# Altium project FLEXI_HAL_Quark.PrjPCB (part 5 of 5)
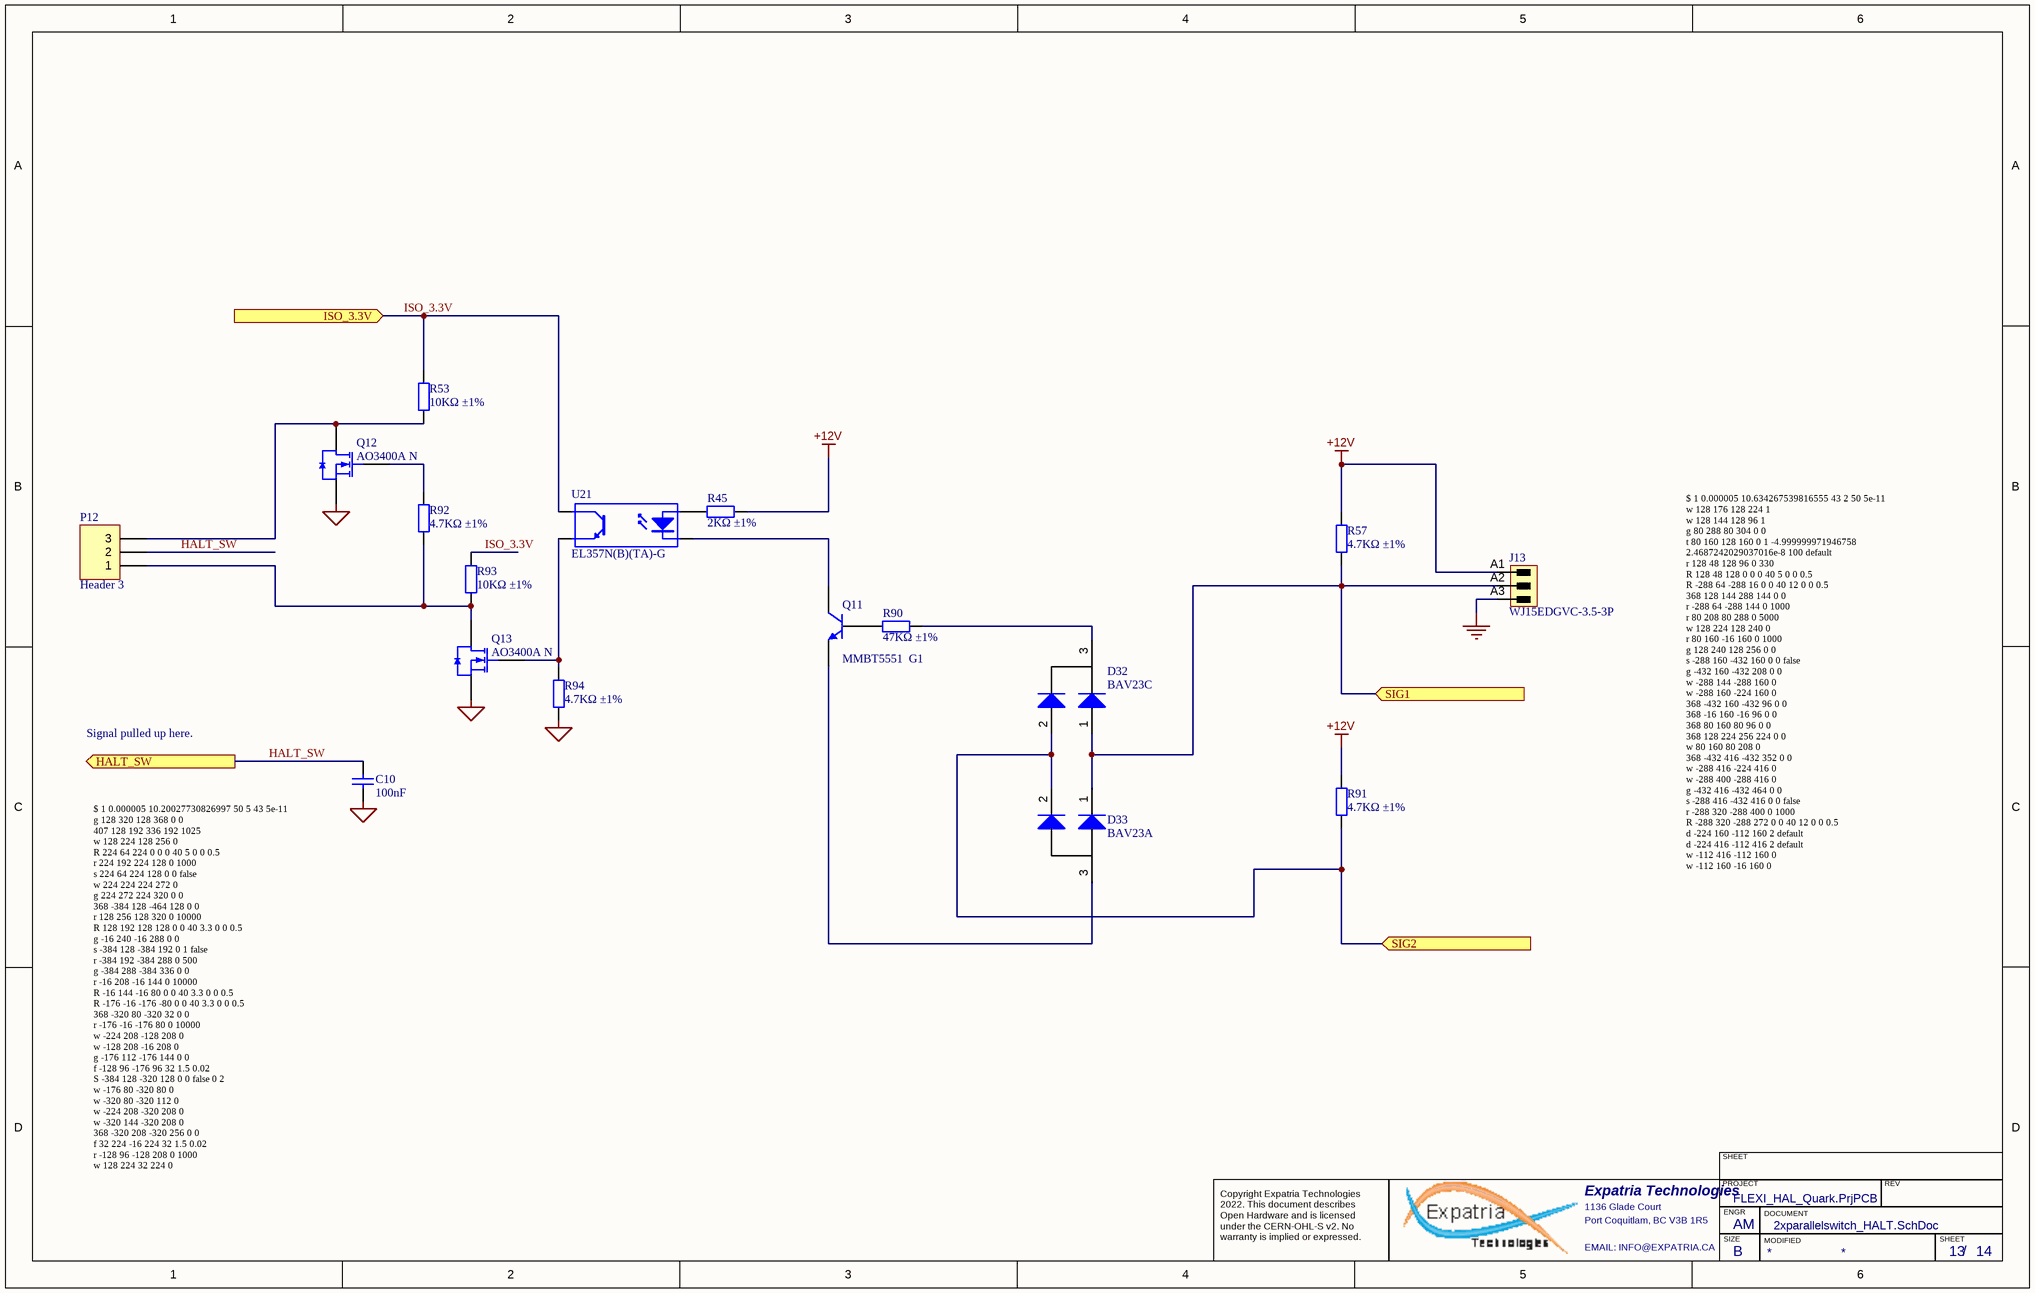
[diagram p23: 2xparallelswitch_HALT.SchDoc]

## Nets that join several sheets
+3.3V: Flexi_Quark_board (D24.A), STM32F446 CNC Controller/ST/SX (5 pins), STM32F446 CNC Controller/ST/SY (5 pins), STM32F446 CNC Controller/ST/SZ (5 pins), STM32F446 CNC Controller/ST/SA (5 pins), STM32F446 CNC Controller/ST/SB (5 pins), STM32F446 CNC Controller/ST/SC (5 pins), STM32F446 CNC Controller/ST/AO (R64_STM32F446_CNC_Controller_ST_AO#1.2), STM32F446 CNC Controller/ST/AO (R178_STM32F446_CNC_Controller_ST_AO#2.2), STM32F446 CNC Controller/MODBUS/RS (R65_RS.2), MCU_STM32H723ZGT6 (48 pins), Ethernet_Interface (6 pins), USB_ULPI_Interface (9 pins), STM32F446 CNC Controller/Pendant RT Interface/CB (R65_CB.2), STM32F446 CNC Controller/4 Encoder Inputs/EI (R178_STM32F446_CNC_Controller_4_Encoder_Inputs_EI#1.2), STM32F446 CNC Controller/4 Encoder Inputs/EI (R178_STM32F446_CNC_Controller_4_Encoder_Inputs_EI#2.2), STM32F446 CNC Controller/4 Encoder Inputs/EI (R178_STM32F446_CNC_Controller_4_Encoder_Inputs_EI#3.2), STM32F446 CNC Controller/4 Encoder Inputs/EI (R178_STM32F446_CNC_Controller_4_Encoder_Inputs_EI#4.2), STM32F446 CNC Controller/4 Encoder Inputs/EI (R178_STM32F446_CNC_Controller_4_Encoder_Inputs_EI#5.2), STM32F446 CNC Controller/4 Encoder Inputs/EI (R178_STM32F446_CNC_Controller_4_Encoder_Inputs_EI#6.2), Serial_Expansion (D40.2 R136.2), Limit_Switches (6 pins), STM32F446 CNC Controller/Mezzanine Connector/LIM_SW/PH_DR (R20_STM32F446_CNC_Controller_Mezzanine_Connector_LIM_SW_PH_DR#1.2), STM32F446 CNC Controller/Mezzanine Connector/LIM_SW/PH_DR (R20_STM32F446_CNC_Controller_Mezzanine_Connector_LIM_SW_PH_DR#2.2), STM32F446 CNC Controller/Mezzanine Connector/LIM_SW/PH_DR (R20_STM32F446_CNC_Controller_Mezzanine_Connector_LIM_SW_PH_DR#3.2), STM32F446 CNC Controller/Mezzanine Connector/LIM_SW/PH_DR (R20_STM32F446_CNC_Controller_Mezzanine_Connector_LIM_SW_PH_DR#4.2), STM32F446 CNC Controller/Mezzanine Connector/LIM_SW/PH_DR (R20_STM32F446_CNC_Controller_Mezzanine_Connector_LIM_SW_PH_DR#5.2), STM32F446 CNC Controller/Mezzanine Connector/LIM_SW/PH_DR (R20_STM32F446_CNC_Controller_Mezzanine_Connector_LIM_SW_PH_DR#6.2), Misc_switches (5 pins), STM32F446 CNC Controller/Mezzanine Connector/USR_SW/PH_CY (R20_PH_CY.2), STM32F446 CNC Controller/Mezzanine Connector/USR_SW/PH_FD (R20_PH_FD.2), STM32F446 CNC Controller/Mezzanine Connector/USR_SW/PH_DR (R20_STM32F446_CNC_Controller_Mezzanine_Connector_USR_SW_PH_DR.2), STM32F446 CNC Controller/Mezzanine Connector/USR_SW/PH_TL (R20_PH_TL.2), STM32F446 CNC Controller/Mezzanine Connector/USR_SW/PH_PR (R20_PH_PR.2), STM32F446 CNC Controller/Mezzanine Connector/AUX_I/AI (R178_STM32F446_CNC_Controller_Mezzanine_Connector_AUX_I_AI#1.2), STM32F446 CNC Controller/Mezzanine Connector/AUX_I/AI (R178_STM32F446_CNC_Controller_Mezzanine_Connector_AUX_I_AI#2.2), STM32F446 CNC Controller/Mezzanine Connector/MZ (R64_STM32F446_CNC_Controller_Mezzanine_Connector_MZ#1.2), STM32F446 CNC Controller/Mezzanine Connector/MZ (R64_STM32F446_CNC_Controller_Mezzanine_Connector_MZ#2.2), STM32F446 CNC Controller/Mezzanine Connector/MZ (R64_STM32F446_CNC_Controller_Mezzanine_Connector_MZ#3.2), STM32F446 CNC Controller/Mezzanine Connector/MZ (R64_STM32F446_CNC_Controller_Mezzanine_Connector_MZ#4.2), STM32F446 CNC Controller/Mezzanine Connector/MZ (R64_STM32F446_CNC_Controller_Mezzanine_Connector_MZ#5.2), STM32F446 CNC Controller/Mezzanine Connector/MZ (R64_STM32F446_CNC_Controller_Mezzanine_Connector_MZ#6.2), 2xparallelswitch_HALT (R53.2 R93.2 U21.4)
+5V: Flexi_Quark_board (C49.2 D2.A D19.2 L1.1), STM32F446 CNC Controller/ST/SX (11 pins), STM32F446 CNC Controller/ST/SY (11 pins), STM32F446 CNC Controller/ST/SZ (11 pins), STM32F446 CNC Controller/ST/SA (11 pins), STM32F446 CNC Controller/ST/SB (11 pins), STM32F446 CNC Controller/ST/SC (11 pins), STM32F446 CNC Controller/ST/AO (R178_STM32F446_CNC_Controller_ST_AO#1.2), STM32F446 CNC Controller/ST/AO (R64_STM32F446_CNC_Controller_ST_AO#2.2), RS485 (C108.2 L4.1 R89.2), 5V_Power_Supply (6 pins), CANBUS_Pendant (6 pins), STM32F446 CNC Controller/Pendant RT Interface/CB (R60_CB.2), Encoder_Input (12 pins), STM32F446 CNC Controller/4 Encoder Inputs/U_ENC0 (J2_U_ENC0.7), STM32F446 CNC Controller/4 Encoder Inputs/U_ENC1 (J2_U_ENC1.7), STM32F446 CNC Controller/4 Encoder Inputs/U_ENC2 (J2_U_ENC2.7), STM32F446 CNC Controller/4 Encoder Inputs/U_ENC3 (J2_U_ENC3.7), STM32F446 CNC Controller/4 Encoder Inputs/EI (R64_STM32F446_CNC_Controller_4_Encoder_Inputs_EI#1.2), STM32F446 CNC Controller/4 Encoder Inputs/EI (R64_STM32F446_CNC_Controller_4_Encoder_Inputs_EI#2.2), STM32F446 CNC Controller/4 Encoder Inputs/EI (R64_STM32F446_CNC_Controller_4_Encoder_Inputs_EI#3.2), STM32F446 CNC Controller/4 Encoder Inputs/EI (R64_STM32F446_CNC_Controller_4_Encoder_Inputs_EI#4.2), STM32F446 CNC Controller/4 Encoder Inputs/EI (R64_STM32F446_CNC_Controller_4_Encoder_Inputs_EI#5.2), STM32F446 CNC Controller/4 Encoder Inputs/EI (R64_STM32F446_CNC_Controller_4_Encoder_Inputs_EI#6.2), Serial_Expansion (11 pins), Mezz_connector (P2.10), Aux_Inputs (D30.2 D31.2 D35.2 D37.2), STM32F446 CNC Controller/Mezzanine Connector/AUX_I/AI (R64_STM32F446_CNC_Controller_Mezzanine_Connector_AUX_I_AI#1.2), STM32F446 CNC Controller/Mezzanine Connector/AUX_I/AI (R64_STM32F446_CNC_Controller_Mezzanine_Connector_AUX_I_AI#2.2), STM32F446 CNC Controller/Mezzanine Connector/MZ (R178_STM32F446_CNC_Controller_Mezzanine_Connector_MZ#1.2), STM32F446 CNC Controller/Mezzanine Connector/MZ (R178_STM32F446_CNC_Controller_Mezzanine_Connector_MZ#2.2), STM32F446 CNC Controller/Mezzanine Connector/MZ (R178_STM32F446_CNC_Controller_Mezzanine_Connector_MZ#3.2), STM32F446 CNC Controller/Mezzanine Connector/MZ (R178_STM32F446_CNC_Controller_Mezzanine_Connector_MZ#4.2), STM32F446 CNC Controller/Mezzanine Connector/MZ (R178_STM32F446_CNC_Controller_Mezzanine_Connector_MZ#5.2), STM32F446 CNC Controller/Mezzanine Connector/MZ (R178_STM32F446_CNC_Controller_Mezzanine_Connector_MZ#6.2)
+5V_MCU: Flexi_Quark_board (7 pins), RS485 (D59.A), MCU_STM32H723ZGT6 (C12.2 VR3.3), USB_ULPI_Interface (C158.2 J5.A4B9 J5.B4A9 R159.2), CANBUS_Pendant (D57.A), Serial_Expansion (D61.A), Mezz_connector (P2.1)
+5V_RS485: RS485 (8 pins), STM32F446 CNC Controller/MODBUS/RS (R60_RS.2)
+12V: Flexi_Quark_board (D10.A D21.2 FUSE1.2 J7.1), STM32F446 CNC Controller/ST/SX (C92_SX.2 P15_SX.9 QS1_SX.JP1_9), STM32F446 CNC Controller/ST/SY (C92_SY.2 P15_SY.9 QS1_SY.JP1_9), STM32F446 CNC Controller/ST/SZ (C92_SZ.2 P15_SZ.9 QS1_SZ.JP1_9), STM32F446 CNC Controller/ST/SA (C92_SA.2 P15_SA.9 QS1_SA.JP1_9), STM32F446 CNC Controller/ST/SB (C92_SB.2 P15_SB.9 QS1_SB.JP1_9), STM32F446 CNC Controller/ST/SC (C92_SC.2 P15_SC.9 QS1_SC.JP1_9), 5V_Power_Supply (C46.2 C47.2 U23.2), Mezz_connector (P2.12), 2xparallelswitch_HALT (J13.A1 R45.2 R57.2 R91.2)
GND: Flexi_Quark_board (11 pins), STM32F446 CNC Controller/ST/SX (25 pins), STM32F446 CNC Controller/ST/SY (25 pins), STM32F446 CNC Controller/ST/SZ (25 pins), STM32F446 CNC Controller/ST/SA (25 pins), STM32F446 CNC Controller/ST/SB (25 pins), STM32F446 CNC Controller/ST/SC (25 pins), STM32F446 CNC Controller/ST/AO (C67_STM32F446_CNC_Controller_ST_AO#1.1 U33_STM32F446_CNC_Controller_ST_AO#1.5), STM32F446 CNC Controller/ST/AO (C68_STM32F446_CNC_Controller_ST_AO#2.2 U33_STM32F446_CNC_Controller_ST_AO#2.4), RS485 (C108.1 L6.1), STM32F446 CNC Controller/MODBUS/RS (C1_RS.1), 5V_Power_Supply (12 pins), 12V_Power_Supply (11 pins), CANBUS_Pendant (6 pins), STM32F446 CNC Controller/Pendant RT Interface/CB (C1_CB.1 U16_CB.5), Encoder_Input (12 pins), STM32F446 CNC Controller/4 Encoder Inputs/U_ENC0 (J2_U_ENC0.2 J2_U_ENC0.4), STM32F446 CNC Controller/4 Encoder Inputs/U_ENC1 (J2_U_ENC1.2 J2_U_ENC1.4), STM32F446 CNC Controller/4 Encoder Inputs/U_ENC2 (J2_U_ENC2.2 J2_U_ENC2.4), STM32F446 CNC Controller/4 Encoder Inputs/U_ENC3 (J2_U_ENC3.2 J2_U_ENC3.4), STM32F446 CNC Controller/4 Encoder Inputs/EI (C68_STM32F446_CNC_Controller_4_Encoder_Inputs_EI#1.2 U33_STM32F446_CNC_Controller_4_Encoder_Inputs_EI#1.4), STM32F446 CNC Controller/4 Encoder Inputs/EI (C68_STM32F446_CNC_Controller_4_Encoder_Inputs_EI#2.2 U33_STM32F446_CNC_Controller_4_Encoder_Inputs_EI#2.4), STM32F446 CNC Controller/4 Encoder Inputs/EI (C68_STM32F446_CNC_Controller_4_Encoder_Inputs_EI#3.2 U33_STM32F446_CNC_Controller_4_Encoder_Inputs_EI#3.4), STM32F446 CNC Controller/4 Encoder Inputs/EI (C68_STM32F446_CNC_Controller_4_Encoder_Inputs_EI#4.2 U33_STM32F446_CNC_Controller_4_Encoder_Inputs_EI#4.4), STM32F446 CNC Controller/4 Encoder Inputs/EI (C68_STM32F446_CNC_Controller_4_Encoder_Inputs_EI#5.2 U33_STM32F446_CNC_Controller_4_Encoder_Inputs_EI#5.4), STM32F446 CNC Controller/4 Encoder Inputs/EI (C68_STM32F446_CNC_Controller_4_Encoder_Inputs_EI#6.2 U33_STM32F446_CNC_Controller_4_Encoder_Inputs_EI#6.4), Serial_Expansion (14 pins), Mezz_connector (10 pins), Aux_Inputs (D49.1 D50.1 D51.1 D52.1), STM32F446 CNC Controller/Mezzanine Connector/AUX_I/AI (C68_STM32F446_CNC_Controller_Mezzanine_Connector_AUX_I_AI#1.2 U33_STM32F446_CNC_Controller_Mezzanine_Connector_AUX_I_AI#1.4), STM32F446 CNC Controller/Mezzanine Connector/AUX_I/AI (C68_STM32F446_CNC_Controller_Mezzanine_Connector_AUX_I_AI#2.2 U33_STM32F446_CNC_Controller_Mezzanine_Connector_AUX_I_AI#2.4), STM32F446 CNC Controller/Mezzanine Connector/MZ (C67_STM32F446_CNC_Controller_Mezzanine_Connector_MZ#1.1 U33_STM32F446_CNC_Controller_Mezzanine_Connector_MZ#1.5), STM32F446 CNC Controller/Mezzanine Connector/MZ (C67_STM32F446_CNC_Controller_Mezzanine_Connector_MZ#2.1 U33_STM32F446_CNC_Controller_Mezzanine_Connector_MZ#2.5), STM32F446 CNC Controller/Mezzanine Connector/MZ (C67_STM32F446_CNC_Controller_Mezzanine_Connector_MZ#3.1 U33_STM32F446_CNC_Controller_Mezzanine_Connector_MZ#3.5), STM32F446 CNC Controller/Mezzanine Connector/MZ (C67_STM32F446_CNC_Controller_Mezzanine_Connector_MZ#4.1 U33_STM32F446_CNC_Controller_Mezzanine_Connector_MZ#4.5), STM32F446 CNC Controller/Mezzanine Connector/MZ (C67_STM32F446_CNC_Controller_Mezzanine_Connector_MZ#5.1 U33_STM32F446_CNC_Controller_Mezzanine_Connector_MZ#5.5), STM32F446 CNC Controller/Mezzanine Connector/MZ (C67_STM32F446_CNC_Controller_Mezzanine_Connector_MZ#6.1 U33_STM32F446_CNC_Controller_Mezzanine_Connector_MZ#6.5), 2xparallelswitch_HALT (J13.A3)
MCU_GND: Flexi_Quark_board (13 pins), Stepper_driver_group (C9.2), STM32F446 CNC Controller/ST/SX (9 pins), STM32F446 CNC Controller/ST/SY (9 pins), STM32F446 CNC Controller/ST/SZ (9 pins), STM32F446 CNC Controller/ST/SA (9 pins), STM32F446 CNC Controller/ST/SB (9 pins), STM32F446 CNC Controller/ST/SC (9 pins), STM32F446 CNC Controller/ST/AO (C68_STM32F446_CNC_Controller_ST_AO#1.2 U33_STM32F446_CNC_Controller_ST_AO#1.4), STM32F446 CNC Controller/ST/AO (C67_STM32F446_CNC_Controller_ST_AO#2.1 U33_STM32F446_CNC_Controller_ST_AO#2.5), RS485 (Q18.2), STM32F446 CNC Controller/MODBUS/RS (C2_RS.2 U16_RS.4), MCU_STM32H723ZGT6 (58 pins), Ethernet_Interface (17 pins), USB_ULPI_Interface (24 pins), CANBUS_Pendant (Q17.2), STM32F446 CNC Controller/Pendant RT Interface/CB (C2_CB.2 U16_CB.4), STM32F446 CNC Controller/4 Encoder Inputs/EI (C67_STM32F446_CNC_Controller_4_Encoder_Inputs_EI#1.1 U33_STM32F446_CNC_Controller_4_Encoder_Inputs_EI#1.5), STM32F446 CNC Controller/4 Encoder Inputs/EI (C67_STM32F446_CNC_Controller_4_Encoder_Inputs_EI#2.1 U33_STM32F446_CNC_Controller_4_Encoder_Inputs_EI#2.5), STM32F446 CNC Controller/4 Encoder Inputs/EI (C67_STM32F446_CNC_Controller_4_Encoder_Inputs_EI#3.1 U33_STM32F446_CNC_Controller_4_Encoder_Inputs_EI#3.5), STM32F446 CNC Controller/4 Encoder Inputs/EI (C67_STM32F446_CNC_Controller_4_Encoder_Inputs_EI#4.1 U33_STM32F446_CNC_Controller_4_Encoder_Inputs_EI#4.5), STM32F446 CNC Controller/4 Encoder Inputs/EI (C67_STM32F446_CNC_Controller_4_Encoder_Inputs_EI#5.1 U33_STM32F446_CNC_Controller_4_Encoder_Inputs_EI#5.5), STM32F446 CNC Controller/4 Encoder Inputs/EI (C67_STM32F446_CNC_Controller_4_Encoder_Inputs_EI#6.1 U33_STM32F446_CNC_Controller_4_Encoder_Inputs_EI#6.5), Serial_Expansion (C60.2 D40.1 Q20.2 U12.4), Mezz_connector (P2.7 P2.8), STM32F446 CNC Controller/Mezzanine Connector/LIM_SW/PH_DR (C54_STM32F446_CNC_Controller_Mezzanine_Connector_LIM_SW_PH_DR#1.1 U2_STM32F446_CNC_Controller_Mezzanine_Connector_LIM_SW_PH_DR#1.3), STM32F446 CNC Controller/Mezzanine Connector/LIM_SW/PH_DR (C54_STM32F446_CNC_Controller_Mezzanine_Connector_LIM_SW_PH_DR#2.1 U2_STM32F446_CNC_Controller_Mezzanine_Connector_LIM_SW_PH_DR#2.3), STM32F446 CNC Controller/Mezzanine Connector/LIM_SW/PH_DR (C54_STM32F446_CNC_Controller_Mezzanine_Connector_LIM_SW_PH_DR#3.1 U2_STM32F446_CNC_Controller_Mezzanine_Connector_LIM_SW_PH_DR#3.3), STM32F446 CNC Controller/Mezzanine Connector/LIM_SW/PH_DR (C54_STM32F446_CNC_Controller_Mezzanine_Connector_LIM_SW_PH_DR#4.1 U2_STM32F446_CNC_Controller_Mezzanine_Connector_LIM_SW_PH_DR#4.3), STM32F446 CNC Controller/Mezzanine Connector/LIM_SW/PH_DR (C54_STM32F446_CNC_Controller_Mezzanine_Connector_LIM_SW_PH_DR#5.1 U2_STM32F446_CNC_Controller_Mezzanine_Connector_LIM_SW_PH_DR#5.3), STM32F446 CNC Controller/Mezzanine Connector/LIM_SW/PH_DR (C54_STM32F446_CNC_Controller_Mezzanine_Connector_LIM_SW_PH_DR#6.1 U2_STM32F446_CNC_Controller_Mezzanine_Connector_LIM_SW_PH_DR#6.3), STM32F446 CNC Controller/Mezzanine Connector/USR_SW/PH_CY (C54_PH_CY.1 U2_PH_CY.3), STM32F446 CNC Controller/Mezzanine Connector/USR_SW/PH_FD (C54_PH_FD.1 U2_PH_FD.3), STM32F446 CNC Controller/Mezzanine Connector/USR_SW/PH_DR (C54_STM32F446_CNC_Controller_Mezzanine_Connector_USR_SW_PH_DR.1 U2_STM32F446_CNC_Controller_Mezzanine_Connector_USR_SW_PH_DR.3), STM32F446 CNC Controller/Mezzanine Connector/USR_SW/PH_TL (C54_PH_TL.1 U2_PH_TL.3), STM32F446 CNC Controller/Mezzanine Connector/USR_SW/PH_PR (C54_PH_PR.1 U2_PH_PR.3), Aux_Inputs (R78.2 R81.2 R82.2 R87.2), STM32F446 CNC Controller/Mezzanine Connector/AUX_I/AI (C67_STM32F446_CNC_Controller_Mezzanine_Connector_AUX_I_AI#1.1 U33_STM32F446_CNC_Controller_Mezzanine_Connector_AUX_I_AI#1.5), STM32F446 CNC Controller/Mezzanine Connector/AUX_I/AI (C67_STM32F446_CNC_Controller_Mezzanine_Connector_AUX_I_AI#2.1 U33_STM32F446_CNC_Controller_Mezzanine_Connector_AUX_I_AI#2.5), STM32F446 CNC Controller/Mezzanine Connector/MZ (C68_STM32F446_CNC_Controller_Mezzanine_Connector_MZ#1.2 U33_STM32F446_CNC_Controller_Mezzanine_Connector_MZ#1.4), STM32F446 CNC Controller/Mezzanine Connector/MZ (C68_STM32F446_CNC_Controller_Mezzanine_Connector_MZ#2.2 U33_STM32F446_CNC_Controller_Mezzanine_Connector_MZ#2.4), STM32F446 CNC Controller/Mezzanine Connector/MZ (C68_STM32F446_CNC_Controller_Mezzanine_Connector_MZ#3.2 U33_STM32F446_CNC_Controller_Mezzanine_Connector_MZ#3.4), STM32F446 CNC Controller/Mezzanine Connector/MZ (C68_STM32F446_CNC_Controller_Mezzanine_Connector_MZ#4.2 U33_STM32F446_CNC_Controller_Mezzanine_Connector_MZ#4.4), STM32F446 CNC Controller/Mezzanine Connector/MZ (C68_STM32F446_CNC_Controller_Mezzanine_Connector_MZ#5.2 U33_STM32F446_CNC_Controller_Mezzanine_Connector_MZ#5.4), STM32F446 CNC Controller/Mezzanine Connector/MZ (C68_STM32F446_CNC_Controller_Mezzanine_Connector_MZ#6.2 U33_STM32F446_CNC_Controller_Mezzanine_Connector_MZ#6.4), 2xparallelswitch_HALT (C10.1 Q12.2 Q13.2 R94.1)
MOD_GND: RS485 (11 pins), STM32F446 CNC Controller/MODBUS/RS (U16_RS.5)
MOTOR_VCC_48V: Flexi_Quark_board (D41.2 D42.2 Q2.2), STM32F446 CNC Controller/ST/SX (10 pins), STM32F446 CNC Controller/ST/SY (10 pins), STM32F446 CNC Controller/ST/SZ (10 pins), STM32F446 CNC Controller/ST/SA (10 pins), STM32F446 CNC Controller/ST/SB (10 pins), STM32F446 CNC Controller/ST/SC (10 pins), 12V_Power_Supply (5 pins), Mezz_connector (P2.53)
A_LIM: MCU_STM32H723ZGT6 (U30.91), Limit_Switches (R19.2), STM32F446 CNC Controller/Mezzanine Connector/LIM_SW/PH_DR (C54_STM32F446_CNC_Controller_Mezzanine_Connector_LIM_SW_PH_DR#4.2 R20_STM32F446_CNC_Controller_Mezzanine_Connector_LIM_SW_PH_DR#4.1 U2_STM32F446_CNC_Controller_Mezzanine_Connector_LIM_SW_PH_DR#4.4)
ALIM_EXT_n: Mezz_connector (P2.23), STM32F446 CNC Controller/Mezzanine Connector/LIM_SW/PH_DR (U2_STM32F446_CNC_Controller_Mezzanine_Connector_LIM_SW_PH_DR#4.2)
ALIM_EXT_p: Mezz_connector (P2.21), STM32F446 CNC Controller/Mezzanine Connector/LIM_SW/PH_DR (R21_STM32F446_CNC_Controller_Mezzanine_Connector_LIM_SW_PH_DR#4.1)
AUXIN0_ISO: Mezz_connector (P2.33), Aux_Inputs (R69.1)
AUXIN1_ISO: Mezz_connector (P2.35), Aux_Inputs (R75.1)
AUXIN2_ISO: Mezz_connector (P2.37), Aux_Inputs (R95.1)
AUXIN3_ISO: Mezz_connector (P2.39), Aux_Inputs (R96.1)
AUXIN_0: MCU_STM32H723ZGT6 (U30.137), Aux_Inputs (D20.A), STM32F446 CNC Controller/Mezzanine Connector/AUX_I/AI (U33_STM32F446_CNC_Controller_Mezzanine_Connector_AUX_I_AI#1.7)
AUXIN_1: MCU_STM32H723ZGT6 (U30.81), Aux_Inputs (D22.A), STM32F446 CNC Controller/Mezzanine Connector/AUX_I/AI (U33_STM32F446_CNC_Controller_Mezzanine_Connector_AUX_I_AI#1.6)
AUXIN_2: MCU_STM32H723ZGT6 (U30.88), Aux_Inputs (D28.A), STM32F446 CNC Controller/Mezzanine Connector/AUX_I/AI (U33_STM32F446_CNC_Controller_Mezzanine_Connector_AUX_I_AI#2.7)
AUXIN_3: MCU_STM32H723ZGT6 (U30.60), Aux_Inputs (D29.A), STM32F446 CNC Controller/Mezzanine Connector/AUX_I/AI (U33_STM32F446_CNC_Controller_Mezzanine_Connector_AUX_I_AI#2.6)
AUXOUT0_ISO: Mezz_connector (P2.41), STM32F446 CNC Controller/Mezzanine Connector/MZ (U33_STM32F446_CNC_Controller_Mezzanine_Connector_MZ#6.7)
AUXOUT1_ISO: Mezz_connector (P2.43), STM32F446 CNC Controller/Mezzanine Connector/MZ (U33_STM32F446_CNC_Controller_Mezzanine_Connector_MZ#6.6)
AUXOUT2_ISO: Mezz_connector (P2.45), STM32F446 CNC Controller/Mezzanine Connector/MZ (U33_STM32F446_CNC_Controller_Mezzanine_Connector_MZ#5.7)
AUXOUT3_ISO: Mezz_connector (P2.47), STM32F446 CNC Controller/Mezzanine Connector/MZ (U33_STM32F446_CNC_Controller_Mezzanine_Connector_MZ#5.6)
AUXOUT_0: MCU_STM32H723ZGT6 (U30.140), STM32F446 CNC Controller/Mezzanine Connector/MZ (U33_STM32F446_CNC_Controller_Mezzanine_Connector_MZ#6.2)
AUXOUT_1: MCU_STM32H723ZGT6 (U30.139), STM32F446 CNC Controller/Mezzanine Connector/MZ (U33_STM32F446_CNC_Controller_Mezzanine_Connector_MZ#6.3)
AUXOUT_2: MCU_STM32H723ZGT6 (J6.4 P37.4 U30.109), STM32F446 CNC Controller/Mezzanine Connector/MZ (U33_STM32F446_CNC_Controller_Mezzanine_Connector_MZ#5.2)
AUXOUT_3: MCU_STM32H723ZGT6 (J6.2 P37.2 U30.105), STM32F446 CNC Controller/Mezzanine Connector/MZ (U33_STM32F446_CNC_Controller_Mezzanine_Connector_MZ#5.3)
B_LIM: MCU_STM32H723ZGT6 (U30.67), Limit_Switches (R24.2), STM32F446 CNC Controller/Mezzanine Connector/LIM_SW/PH_DR (C54_STM32F446_CNC_Controller_Mezzanine_Connector_LIM_SW_PH_DR#5.2 R20_STM32F446_CNC_Controller_Mezzanine_Connector_LIM_SW_PH_DR#5.1 U2_STM32F446_CNC_Controller_Mezzanine_Connector_LIM_SW_PH_DR#5.4)
BLIM_EXT_n: Mezz_connector (P2.27), STM32F446 CNC Controller/Mezzanine Connector/LIM_SW/PH_DR (U2_STM32F446_CNC_Controller_Mezzanine_Connector_LIM_SW_PH_DR#5.2)
BLIM_EXT_p: Mezz_connector (P2.25), STM32F446 CNC Controller/Mezzanine Connector/LIM_SW/PH_DR (R21_STM32F446_CNC_Controller_Mezzanine_Connector_LIM_SW_PH_DR#5.1)
C_LIM: MCU_STM32H723ZGT6 (U30.13), Limit_Switches (R25.2), STM32F446 CNC Controller/Mezzanine Connector/LIM_SW/PH_DR (C54_STM32F446_CNC_Controller_Mezzanine_Connector_LIM_SW_PH_DR#6.2 R20_STM32F446_CNC_Controller_Mezzanine_Connector_LIM_SW_PH_DR#6.1 U2_STM32F446_CNC_Controller_Mezzanine_Connector_LIM_SW_PH_DR#6.4)
CAN_RX: MCU_STM32H723ZGT6 (U30.125), CANBUS_Pendant (Q17.1), STM32F446 CNC Controller/Pendant RT Interface/CB (U16_CB.2)
CAN_TX: MCU_STM32H723ZGT6 (U30.82), STM32F446 CNC Controller/Pendant RT Interface/CB (U16_CB.3)
CAN_TX_5V: CANBUS_Pendant (Q15.1 U17.1), STM32F446 CNC Controller/Pendant RT Interface/CB (U16_CB.6)
CLIM_EXT_n: Mezz_connector (P2.31), STM32F446 CNC Controller/Mezzanine Connector/LIM_SW/PH_DR (U2_STM32F446_CNC_Controller_Mezzanine_Connector_LIM_SW_PH_DR#6.2)
CLIM_EXT_p: Mezz_connector (P2.29), STM32F446 CNC Controller/Mezzanine Connector/LIM_SW/PH_DR (R21_STM32F446_CNC_Controller_Mezzanine_Connector_LIM_SW_PH_DR#6.1)
COOLANT: MCU_STM32H723ZGT6 (U30.8), STM32F446 CNC Controller/Mezzanine Connector/MZ (U33_STM32F446_CNC_Controller_Mezzanine_Connector_MZ#1.3)
COOLANT_ISO: Mezz_connector (P2.60), STM32F446 CNC Controller/Mezzanine Connector/MZ (U33_STM32F446_CNC_Controller_Mezzanine_Connector_MZ#1.6)
CS_A: STM32F446 CNC Controller/ST/SA (U41_SA.2), MCU_STM32H723ZGT6 (U30.22)
CS_B: STM32F446 CNC Controller/ST/SB (U41_SB.2), MCU_STM32H723ZGT6 (U30.34)
CS_C: STM32F446 CNC Controller/ST/SC (U41_SC.2), MCU_STM32H723ZGT6 (U30.75)
CS_X: STM32F446 CNC Controller/ST/SX (U41_SX.2), MCU_STM32H723ZGT6 (U30.57)
CS_Y: STM32F446 CNC Controller/ST/SY (U41_SY.2), MCU_STM32H723ZGT6 (U30.89)
CS_Z: STM32F446 CNC Controller/ST/SZ (U41_SZ.2), MCU_STM32H723ZGT6 (U30.129)
CYC/ST: MCU_STM32H723ZGT6 (U30.64), Misc_switches (R11.2), STM32F446 CNC Controller/Mezzanine Connector/USR_SW/PH_CY (C54_PH_CY.2 R20_PH_CY.1 U2_PH_CY.4)
DIR_A: STM32F446 CNC Controller/ST/SA (U42_SA.3), MCU_STM32H723ZGT6 (U30.78)
DIR_B: STM32F446 CNC Controller/ST/SB (U42_SB.3), MCU_STM32H723ZGT6 (U30.79)
DIR_C: STM32F446 CNC Controller/ST/SC (U42_SC.3), MCU_STM32H723ZGT6 (U30.80)
DIR_X: STM32F446 CNC Controller/ST/SX (U42_SX.3), MCU_STM32H723ZGT6 (U30.114)
DIR_Y: STM32F446 CNC Controller/ST/SY (U42_SY.3), MCU_STM32H723ZGT6 (U30.115)
DIR_Z: STM32F446 CNC Controller/ST/SZ (U42_SZ.3), MCU_STM32H723ZGT6 (U30.85)
DOOR: MCU_STM32H723ZGT6 (U30.68), Misc_switches (R74.2), STM32F446 CNC Controller/Mezzanine Connector/USR_SW/PH_DR (C54_STM32F446_CNC_Controller_Mezzanine_Connector_USR_SW_PH_DR.2 R20_STM32F446_CNC_Controller_Mezzanine_Connector_USR_SW_PH_DR.1 U2_STM32F446_CNC_Controller_Mezzanine_Connector_USR_SW_PH_DR.4)
DOOR_EXT_n: Mezz_connector (P2.16), STM32F446 CNC Controller/Mezzanine Connector/USR_SW/PH_DR (U2_STM32F446_CNC_Controller_Mezzanine_Connector_USR_SW_PH_DR.2)
DOOR_EXT_p: Mezz_connector (P2.14), STM32F446 CNC Controller/Mezzanine Connector/USR_SW/PH_DR (R21_STM32F446_CNC_Controller_Mezzanine_Connector_USR_SW_PH_DR.1)
ENC0_A_3V3: MCU_STM32H723ZGT6 (U30.42), STM32F446 CNC Controller/4 Encoder Inputs/EI (U33_STM32F446_CNC_Controller_4_Encoder_Inputs_EI#1.7)
ENC0_A_EXT+: Encoder_Input (U36.2), STM32F446 CNC Controller/4 Encoder Inputs/U_ENC0 (J2_U_ENC0.6 R27_U_ENC0.2)
ENC0_A_EXT-: Encoder_Input (U36.1), STM32F446 CNC Controller/4 Encoder Inputs/U_ENC0 (J2_U_ENC0.1 J8_U_ENC0.2)
ENC0_B_3V3: MCU_STM32H723ZGT6 (U30.133), STM32F446 CNC Controller/4 Encoder Inputs/EI (U33_STM32F446_CNC_Controller_4_Encoder_Inputs_EI#1.6)
ENC0_B_EXT+: Encoder_Input (U36.6), STM32F446 CNC Controller/4 Encoder Inputs/U_ENC0 (J2_U_ENC0.8 R28_U_ENC0.2)
ENC0_B_EXT-: Encoder_Input (U36.7), STM32F446 CNC Controller/4 Encoder Inputs/U_ENC0 (J2_U_ENC0.3 J9_U_ENC0.2)
ENC0_Z_3V3: MCU_STM32H723ZGT6 (U30.56), STM32F446 CNC Controller/4 Encoder Inputs/EI (U33_STM32F446_CNC_Controller_4_Encoder_Inputs_EI#2.7)
ENC0_Z_EXT+: Encoder_Input (U36.14), STM32F446 CNC Controller/4 Encoder Inputs/U_ENC0 (J2_U_ENC0.9 R29_U_ENC0.2)
ENC0_Z_EXT-: Encoder_Input (U36.15), STM32F446 CNC Controller/4 Encoder Inputs/U_ENC0 (J2_U_ENC0.5 J10_U_ENC0.2)
ENC1_A_3V3: MCU_STM32H723ZGT6 (U30.110), STM32F446 CNC Controller/4 Encoder Inputs/EI (U33_STM32F446_CNC_Controller_4_Encoder_Inputs_EI#4.7)
ENC1_A_EXT+: Encoder_Input (U38.14), STM32F446 CNC Controller/4 Encoder Inputs/U_ENC1 (J2_U_ENC1.6 R27_U_ENC1.2)
ENC1_A_EXT-: Encoder_Input (U38.15), STM32F446 CNC Controller/4 Encoder Inputs/U_ENC1 (J2_U_ENC1.1 J8_U_ENC1.2)
ENC1_B_3V3: MCU_STM32H723ZGT6 (U30.97), STM32F446 CNC Controller/4 Encoder Inputs/EI (U33_STM32F446_CNC_Controller_4_Encoder_Inputs_EI#3.7)
ENC1_B_EXT+: Encoder_Input (U38.2), STM32F446 CNC Controller/4 Encoder Inputs/U_ENC1 (J2_U_ENC1.8 R28_U_ENC1.2)
ENC1_B_EXT-: Encoder_Input (U38.1), STM32F446 CNC Controller/4 Encoder Inputs/U_ENC1 (J2_U_ENC1.3 J9_U_ENC1.2)
ENC1_Z_3V3: MCU_STM32H723ZGT6 (U30.11), STM32F446 CNC Controller/4 Encoder Inputs/EI (U33_STM32F446_CNC_Controller_4_Encoder_Inputs_EI#2.6)
ENC1_Z_EXT+: Encoder_Input (U36.10), STM32F446 CNC Controller/4 Encoder Inputs/U_ENC1 (J2_U_ENC1.9 R29_U_ENC1.2)
ENC1_Z_EXT-: Encoder_Input (U36.9), STM32F446 CNC Controller/4 Encoder Inputs/U_ENC1 (J2_U_ENC1.5 J10_U_ENC1.2)
ENC2_A_3V3: MCU_STM32H723ZGT6 (U30.18), STM32F446 CNC Controller/4 Encoder Inputs/EI (U33_STM32F446_CNC_Controller_4_Encoder_Inputs_EI#5.7)
ENC2_A_EXT+: Encoder_Input (U39.2), STM32F446 CNC Controller/4 Encoder Inputs/U_ENC2 (J2_U_ENC2.6 R27_U_ENC2.2)
ENC2_A_EXT-: Encoder_Input (U39.1), STM32F446 CNC Controller/4 Encoder Inputs/U_ENC2 (J2_U_ENC2.1 J8_U_ENC2.2)
ENC2_B_3V3: MCU_STM32H723ZGT6 (U30.19), STM32F446 CNC Controller/4 Encoder Inputs/EI (U33_STM32F446_CNC_Controller_4_Encoder_Inputs_EI#3.6)
ENC2_B_EXT+: Encoder_Input (U38.6), STM32F446 CNC Controller/4 Encoder Inputs/U_ENC2 (J2_U_ENC2.8 R28_U_ENC2.2)
ENC2_B_EXT-: Encoder_Input (U38.7), STM32F446 CNC Controller/4 Encoder Inputs/U_ENC2 (J2_U_ENC2.3 J9_U_ENC2.2)
ENC2_Z_3V3: MCU_STM32H723ZGT6 (U30.87), STM32F446 CNC Controller/4 Encoder Inputs/EI (U33_STM32F446_CNC_Controller_4_Encoder_Inputs_EI#4.6)
ENC2_Z_EXT+: Encoder_Input (U38.10), STM32F446 CNC Controller/4 Encoder Inputs/U_ENC2 (J2_U_ENC2.9 R29_U_ENC2.2)
ENC2_Z_EXT-: Encoder_Input (U38.9), STM32F446 CNC Controller/4 Encoder Inputs/U_ENC2 (J2_U_ENC2.5 J10_U_ENC2.2)
ENC3_A_3V3: MCU_STM32H723ZGT6 (U30.49), STM32F446 CNC Controller/4 Encoder Inputs/EI (U33_STM32F446_CNC_Controller_4_Encoder_Inputs_EI#5.6)
ENC3_A_EXT+: Encoder_Input (U39.6), STM32F446 CNC Controller/4 Encoder Inputs/U_ENC3 (J2_U_ENC3.6 R27_U_ENC3.2)
ENC3_A_EXT-: Encoder_Input (U39.7), STM32F446 CNC Controller/4 Encoder Inputs/U_ENC3 (J2_U_ENC3.1 J8_U_ENC3.2)
ENC3_B_3V3: MCU_STM32H723ZGT6 (U30.50), STM32F446 CNC Controller/4 Encoder Inputs/EI (U33_STM32F446_CNC_Controller_4_Encoder_Inputs_EI#6.6)
ENC3_B_EXT+: Encoder_Input (U39.10), STM32F446 CNC Controller/4 Encoder Inputs/U_ENC3 (J2_U_ENC3.8 R28_U_ENC3.2)
ENC3_B_EXT-: Encoder_Input (U39.9), STM32F446 CNC Controller/4 Encoder Inputs/U_ENC3 (J2_U_ENC3.3 J9_U_ENC3.2)
ENC3_Z_3V3: MCU_STM32H723ZGT6 (U30.92), STM32F446 CNC Controller/4 Encoder Inputs/EI (U33_STM32F446_CNC_Controller_4_Encoder_Inputs_EI#6.7)
ENC3_Z_EXT+: Encoder_Input (U39.14), STM32F446 CNC Controller/4 Encoder Inputs/U_ENC3 (J2_U_ENC3.9 R29_U_ENC3.2)
ENC3_Z_EXT-: Encoder_Input (U39.15), STM32F446 CNC Controller/4 Encoder Inputs/U_ENC3 (J2_U_ENC3.5 J10_U_ENC3.2)
ENN_A: STM32F446 CNC Controller/ST/SA (U42_SA.2), MCU_STM32H723ZGT6 (U30.141)
ENN_B: STM32F446 CNC Controller/ST/SB (U42_SB.2), MCU_STM32H723ZGT6 (U30.142)
ENN_C: STM32F446 CNC Controller/ST/SC (U42_SC.2), MCU_STM32H723ZGT6 (U30.59)
ENN_X: STM32F446 CNC Controller/ST/SX (U42_SX.2), MCU_STM32H723ZGT6 (U30.10)
ENN_Y: STM32F446 CNC Controller/ST/SY (U42_SY.2), MCU_STM32H723ZGT6 (U30.12)
ENN_Z: STM32F446 CNC Controller/ST/SZ (U42_SZ.2), MCU_STM32H723ZGT6 (U30.58)
EXTRA_OUTPUT_ISO: Mezz_connector (P2.56), STM32F446 CNC Controller/Mezzanine Connector/MZ (U33_STM32F446_CNC_Controller_Mezzanine_Connector_MZ#3.7)
FASTO0_ISO: Mezz_connector (P2.49), STM32F446 CNC Controller/Mezzanine Connector/MZ (U33_STM32F446_CNC_Controller_Mezzanine_Connector_MZ#4.6)
FASTO1_ISO: Mezz_connector (P2.51), STM32F446 CNC Controller/Mezzanine Connector/MZ (U33_STM32F446_CNC_Controller_Mezzanine_Connector_MZ#4.7)
FD/HLD: MCU_STM32H723ZGT6 (U30.93), Misc_switches (R14.2), STM32F446 CNC Controller/Mezzanine Connector/USR_SW/PH_FD (C54_PH_FD.2 R20_PH_FD.1 U2_PH_FD.4)
HALT_n: Flexi_Quark_board (R41.2), Stepper_driver_group (C9.1), STM32F446 CNC Controller/ST/SX (P19_SX.2), STM32F446 CNC Controller/ST/SY (P19_SY.2), STM32F446 CNC Controller/ST/SZ (P19_SZ.2), STM32F446 CNC Controller/ST/SA (P19_SA.2), STM32F446 CNC Controller/ST/SB (P19_SB.2), STM32F446 CNC Controller/ST/SC (P19_SC.2), MCU_STM32H723ZGT6 (R134.1 U30.104), 2xparallelswitch_HALT (C10.2 P12.2)
HALT_out: Mezz_connector (P2.44), 2xparallelswitch_HALT (D32.2 D33.2 R91.1)
HOLD_EXT_n: Mezz_connector (P2.20), STM32F446 CNC Controller/Mezzanine Connector/USR_SW/PH_FD (U2_PH_FD.2)
HOLD_EXT_p: Mezz_connector (P2.18), STM32F446 CNC Controller/Mezzanine Connector/USR_SW/PH_FD (R21_PH_FD.1)
KPSTR: Flexi_Quark_board (A1.15), MCU_STM32H723ZGT6 (R122.1 U30.63), Mezz_connector (P2.3)
MIST: MCU_STM32H723ZGT6 (U30.9), STM32F446 CNC Controller/Mezzanine Connector/MZ (U33_STM32F446_CNC_Controller_Mezzanine_Connector_MZ#1.2)
MIST_ISO: Mezz_connector (P2.58), STM32F446 CNC Controller/Mezzanine Connector/MZ (U33_STM32F446_CNC_Controller_Mezzanine_Connector_MZ#1.7)
OA1_1: Stepper_driver_group (P4.4), STM32F446 CNC Controller/ST/SY (6 pins)
OA1_1: Stepper_driver_group (P30.4), STM32F446 CNC Controller/ST/SX (6 pins)
OA1_1: Stepper_driver_group (P32.4), STM32F446 CNC Controller/ST/SZ (6 pins)
OA1_1: Stepper_driver_group (P34.4), STM32F446 CNC Controller/ST/SB (6 pins)
OA1_1: Stepper_driver_group (P33.4), STM32F446 CNC Controller/ST/SC (6 pins)
OA1_1: Stepper_driver_group (P31.4), STM32F446 CNC Controller/ST/SA (6 pins)
OA2_1: Stepper_driver_group (P4.3), STM32F446 CNC Controller/ST/SY (6 pins)
OA2_1: Stepper_driver_group (P30.3), STM32F446 CNC Controller/ST/SX (6 pins)
OA2_1: Stepper_driver_group (P32.3), STM32F446 CNC Controller/ST/SZ (6 pins)
OA2_1: Stepper_driver_group (P34.3), STM32F446 CNC Controller/ST/SB (6 pins)
OA2_1: Stepper_driver_group (P33.3), STM32F446 CNC Controller/ST/SC (6 pins)
OA2_1: Stepper_driver_group (P31.3), STM32F446 CNC Controller/ST/SA (6 pins)
OB1_1: Stepper_driver_group (P4.1), STM32F446 CNC Controller/ST/SY (6 pins)
OB1_1: Stepper_driver_group (P30.1), STM32F446 CNC Controller/ST/SX (6 pins)
OB1_1: Stepper_driver_group (P32.1), STM32F446 CNC Controller/ST/SZ (6 pins)
OB1_1: Stepper_driver_group (P34.1), STM32F446 CNC Controller/ST/SB (6 pins)
OB1_1: Stepper_driver_group (P33.1), STM32F446 CNC Controller/ST/SC (6 pins)
OB1_1: Stepper_driver_group (P31.1), STM32F446 CNC Controller/ST/SA (6 pins)
OB2_1: Stepper_driver_group (P4.2), STM32F446 CNC Controller/ST/SY (6 pins)
OB2_1: Stepper_driver_group (P30.2), STM32F446 CNC Controller/ST/SX (6 pins)
OB2_1: Stepper_driver_group (P32.2), STM32F446 CNC Controller/ST/SZ (6 pins)
OB2_1: Stepper_driver_group (P34.2), STM32F446 CNC Controller/ST/SB (6 pins)
OB2_1: Stepper_driver_group (P33.2), STM32F446 CNC Controller/ST/SC (6 pins)
OB2_1: Stepper_driver_group (P31.2), STM32F446 CNC Controller/ST/SA (6 pins)
POWER_OUT_12V: Flexi_Quark_board (FUSE1.1 P1.A1), 12V_Power_Supply (5 pins)
PROBE: MCU_STM32H723ZGT6 (U30.3), Misc_switches (R10.2), STM32F446 CNC Controller/Mezzanine Connector/USR_SW/PH_PR (C54_PH_PR.2 R20_PH_PR.1 U2_PH_PR.4)
PROBE_EXT_n: Mezz_connector (P2.24), STM32F446 CNC Controller/Mezzanine Connector/USR_SW/PH_PR (U2_PH_PR.2)
PROBE_EXT_p: Mezz_connector (P2.22), STM32F446 CNC Controller/Mezzanine Connector/USR_SW/PH_PR (R21_PH_PR.1)
PRU_RESET: Flexi_Quark_board (A1.22), MCU_STM32H723ZGT6 (U30.86)
RMII_CRS_DV: MCU_STM32H723ZGT6 (U30.43), Ethernet_Interface (R129.1)
RMII_MDC: MCU_STM32H723ZGT6 (U30.27), Ethernet_Interface (U35.12)
RMII_MDIO: MCU_STM32H723ZGT6 (U30.36), Ethernet_Interface (U35.13)
RMII_REF_CLK: MCU_STM32H723ZGT6 (U30.35), Ethernet_Interface (R130.1)
RMII_RXD0: MCU_STM32H723ZGT6 (U30.44), Ethernet_Interface (R86.1)
RMII_RXD1: MCU_STM32H723ZGT6 (U30.45), Ethernet_Interface (R88.1)
RMII_TX_EN: MCU_STM32H723ZGT6 (U30.126), Ethernet_Interface (U35.16)
RMII_TXD0: MCU_STM32H723ZGT6 (U30.128), Ethernet_Interface (U35.17)
RMII_TXD1: MCU_STM32H723ZGT6 (U30.127), Ethernet_Interface (U35.18)
RUN_EXT_n: Mezz_connector (P2.32), STM32F446 CNC Controller/Mezzanine Connector/USR_SW/PH_CY (U2_PH_CY.2)
RUN_EXT_p: Mezz_connector (P2.30), STM32F446 CNC Controller/Mezzanine Connector/USR_SW/PH_CY (R21_PH_CY.1)
RXD_EXT: Flexi_Quark_board (A1.29 R97.1), RS485 (Q18.1), STM32F446 CNC Controller/MODBUS/RS (U16_RS.2), MCU_STM32H723ZGT6 (U30.124)
RXD_INT: Flexi_Quark_board (R73.2), MCU_STM32H723ZGT6 (U30.102), Mezz_connector (P2.5)
RXD_OUT: RS485 (R98.1 U11.1), STM32F446 CNC Controller/MODBUS/RS (U16_RS.7)
SCL: Flexi_Quark_board (A1.5), MCU_STM32H723ZGT6 (R124.1 U20.6 U30.54), Mezz_connector (P2.4)
SDA: Flexi_Quark_board (A1.3), MCU_STM32H723ZGT6 (R123.1 U20.5 U30.55), Mezz_connector (P2.2)
SE_REF: Encoder_Input (R23.2 R26.2), STM32F446 CNC Controller/4 Encoder Inputs/U_ENC0 (J8_U_ENC0.3 J9_U_ENC0.3 J10_U_ENC0.3), STM32F446 CNC Controller/4 Encoder Inputs/U_ENC1 (J8_U_ENC1.3 J9_U_ENC1.3 J10_U_ENC1.3), STM32F446 CNC Controller/4 Encoder Inputs/U_ENC2 (J8_U_ENC2.3 J9_U_ENC2.3 J10_U_ENC2.3), STM32F446 CNC Controller/4 Encoder Inputs/U_ENC3 (J8_U_ENC3.3 J9_U_ENC3.3 J10_U_ENC3.3)
SG_A: STM32F446 CNC Controller/ST/SA (U43_SA.7), MCU_STM32H723ZGT6 (U30.7)
SG_B: STM32F446 CNC Controller/ST/SB (U43_SB.7), MCU_STM32H723ZGT6 (U30.132)
SG_C: STM32F446 CNC Controller/ST/SC (U43_SC.7), MCU_STM32H723ZGT6 (U30.14)
SG_X: STM32F446 CNC Controller/ST/SX (U43_SX.7), MCU_STM32H723ZGT6 (U30.15)
SG_Y: STM32F446 CNC Controller/ST/SY (U43_SY.7), MCU_STM32H723ZGT6 (U30.135)
SG_Z: STM32F446 CNC Controller/ST/SZ (U43_SZ.7), MCU_STM32H723ZGT6 (U30.76)
SPI_COMMS.SPI_CLK: Flexi_Quark_board (A1.23), MCU_STM32H723ZGT6 (R34.1)
SPI_COMMS.SPI_PICO: Flexi_Quark_board (A1.19), MCU_STM32H723ZGT6 (R33.1)
SPI_COMMS.SPI_POCI: Flexi_Quark_board (A1.21), MCU_STM32H723ZGT6 (R36.1)
SPI_CS_JOG_SW: Flexi_Quark_board (A1.24), MCU_STM32H723ZGT6 (U30.40)
SPI_MOTOR.SPI_CLK: STM32F446 CNC Controller/ST/AO (U33_STM32F446_CNC_Controller_ST_AO#1.2), MCU_STM32H723ZGT6 (R167.2)
SPI_MOTOR.SPI_PICO: STM32F446 CNC Controller/ST/AO (U33_STM32F446_CNC_Controller_ST_AO#1.3), MCU_STM32H723ZGT6 (R170.1)
SPI_MOTOR.SPI_POCI: STM32F446 CNC Controller/ST/AO (U33_STM32F446_CNC_Controller_ST_AO#2.7), MCU_STM32H723ZGT6 (R168.2)
SPINDLE_DIR: MCU_STM32H723ZGT6 (U30.99), STM32F446 CNC Controller/Mezzanine Connector/MZ (U33_STM32F446_CNC_Controller_Mezzanine_Connector_MZ#2.3)
SPINDLE_DIR_ISO: Mezz_connector (P2.59), STM32F446 CNC Controller/Mezzanine Connector/MZ (U33_STM32F446_CNC_Controller_Mezzanine_Connector_MZ#2.6)
SPINDLE_EN: MCU_STM32H723ZGT6 (U30.103), STM32F446 CNC Controller/Mezzanine Connector/MZ (U33_STM32F446_CNC_Controller_Mezzanine_Connector_MZ#2.2)
SPINDLE_EN_ISO: Mezz_connector (P2.57), STM32F446 CNC Controller/Mezzanine Connector/MZ (U33_STM32F446_CNC_Controller_Mezzanine_Connector_MZ#2.7)
SPINDLE_PWM: MCU_STM32H723ZGT6 (U30.100), STM32F446 CNC Controller/Mezzanine Connector/MZ (U33_STM32F446_CNC_Controller_Mezzanine_Connector_MZ#3.3)
SPINDLE_PWM_ISO: Mezz_connector (P2.55), STM32F446 CNC Controller/Mezzanine Connector/MZ (U33_STM32F446_CNC_Controller_Mezzanine_Connector_MZ#3.6)
STEP_A: STM32F446 CNC Controller/ST/SA (U41_SA.3), MCU_STM32H723ZGT6 (U30.122)
STEP_B: STM32F446 CNC Controller/ST/SB (U41_SB.3), MCU_STM32H723ZGT6 (U30.123)
STEP_C: STM32F446 CNC Controller/ST/SC (U41_SC.3), MCU_STM32H723ZGT6 (U30.77)
STEP_X: STM32F446 CNC Controller/ST/SX (U41_SX.3), MCU_STM32H723ZGT6 (U30.117)
STEP_Y: STM32F446 CNC Controller/ST/SY (U41_SY.3), MCU_STM32H723ZGT6 (U30.118)
STEP_Z: STM32F446 CNC Controller/ST/SZ (U41_SZ.3), MCU_STM32H723ZGT6 (U30.119)
STM_BOOT0: Flexi_Quark_board (R1.1), MCU_STM32H723ZGT6 (C78.2 R131.1 SW5.1 U30.138)
STM_RESET: Flexi_Quark_board (A1.11), MCU_STM32H723ZGT6 (7 pins), Ethernet_Interface (U35.15), USB_ULPI_Interface (U31.9)
STP_SCK_5V: STM32F446 CNC Controller/ST/SX (P15_SX.1 QS1_SX.JP1_1), STM32F446 CNC Controller/ST/SY (P15_SY.1 QS1_SY.JP1_1), STM32F446 CNC Controller/ST/SZ (P15_SZ.1 QS1_SZ.JP1_1), STM32F446 CNC Controller/ST/SA (P15_SA.1 QS1_SA.JP1_1), STM32F446 CNC Controller/ST/SB (P15_SB.1 QS1_SB.JP1_1), STM32F446 CNC Controller/ST/SC (P15_SC.1 QS1_SC.JP1_1), STM32F446 CNC Controller/ST/AO (U33_STM32F446_CNC_Controller_ST_AO#1.7)
STP_SDI_5V: STM32F446 CNC Controller/ST/SX (P15_SX.3 QS1_SX.JP1_3), STM32F446 CNC Controller/ST/SY (P15_SY.3 QS1_SY.JP1_3), STM32F446 CNC Controller/ST/SZ (P15_SZ.3 QS1_SZ.JP1_3), STM32F446 CNC Controller/ST/SA (P15_SA.3 QS1_SA.JP1_3), STM32F446 CNC Controller/ST/SB (P15_SB.3 QS1_SB.JP1_3), STM32F446 CNC Controller/ST/SC (P15_SC.3 QS1_SC.JP1_3), STM32F446 CNC Controller/ST/AO (U33_STM32F446_CNC_Controller_ST_AO#1.6)
STP_SDO_5V: STM32F446 CNC Controller/ST/SX (P15_SX.2 QS1_SX.JP1_2), STM32F446 CNC Controller/ST/SY (P15_SY.2 QS1_SY.JP1_2), STM32F446 CNC Controller/ST/SZ (P15_SZ.2 QS1_SZ.JP1_2), STM32F446 CNC Controller/ST/SA (P15_SA.2 QS1_SA.JP1_2), STM32F446 CNC Controller/ST/SB (P15_SB.2 QS1_SB.JP1_2), STM32F446 CNC Controller/ST/SC (P15_SC.2 QS1_SC.JP1_2), STM32F446 CNC Controller/ST/AO (U33_STM32F446_CNC_Controller_ST_AO#2.2)
TOOL: MCU_STM32H723ZGT6 (U30.134), Misc_switches (R17.2), STM32F446 CNC Controller/Mezzanine Connector/USR_SW/PH_TL (C54_PH_TL.2 R20_PH_TL.1 U2_PH_TL.4)
TOOL_EXT_n: Mezz_connector (P2.28), STM32F446 CNC Controller/Mezzanine Connector/USR_SW/PH_TL (U2_PH_TL.2)
TOOL_EXT_p: Mezz_connector (P2.26), STM32F446 CNC Controller/Mezzanine Connector/USR_SW/PH_TL (R21_PH_TL.1)
TXD_EXT: Flexi_Quark_board (A1.7 R77.1), STM32F446 CNC Controller/MODBUS/RS (U16_RS.3), MCU_STM32H723ZGT6 (U30.96)
TXD_INT: Flexi_Quark_board (R76.2), MCU_STM32H723ZGT6 (U30.101), Mezz_connector (P2.6)
TXD_OUT: RS485 (D14.2 Q19.1 R55.1 U11.4), STM32F446 CNC Controller/MODBUS/RS (U16_RS.6)
ULPI_CLKOUT: MCU_STM32H723ZGT6 (U30.41), USB_ULPI_Interface (U31.14)
ULPI_D0: MCU_STM32H723ZGT6 (U30.37), USB_ULPI_Interface (U31.24)
ULPI_D1: MCU_STM32H723ZGT6 (U30.46), USB_ULPI_Interface (U31.23)
ULPI_D2: MCU_STM32H723ZGT6 (U30.47), USB_ULPI_Interface (U31.22)
ULPI_D3: MCU_STM32H723ZGT6 (U30.69), USB_ULPI_Interface (U31.21)
ULPI_D4: MCU_STM32H723ZGT6 (U30.70), USB_ULPI_Interface (U31.20)
ULPI_D5: MCU_STM32H723ZGT6 (U30.73), USB_ULPI_Interface (U31.19)
ULPI_D6: MCU_STM32H723ZGT6 (U30.74), USB_ULPI_Interface (U31.18)
ULPI_D7: MCU_STM32H723ZGT6 (U30.136), USB_ULPI_Interface (U31.17)
ULPI_DIR: MCU_STM32H723ZGT6 (U30.28), USB_ULPI_Interface (U31.12)
ULPI_NXT: MCU_STM32H723ZGT6 (U30.29), USB_ULPI_Interface (U31.11)
ULPI_STP: MCU_STM32H723ZGT6 (U30.26), USB_ULPI_Interface (U31.13)
USART_RX: MCU_STM32H723ZGT6 (U30.1), Serial_Expansion (Q20.1 U12.2)
USART_TX: MCU_STM32H723ZGT6 (U30.2), Serial_Expansion (U12.3)
VIA: CANBUS_Pendant (U17.4), STM32F446 CNC Controller/Pendant RT Interface/CB (U16_CB.7)
VIA: Encoder_Input (U36.3), STM32F446 CNC Controller/4 Encoder Inputs/EI (U33_STM32F446_CNC_Controller_4_Encoder_Inputs_EI#1.2)
VIA: Encoder_Input (U36.13), STM32F446 CNC Controller/4 Encoder Inputs/EI (U33_STM32F446_CNC_Controller_4_Encoder_Inputs_EI#2.2)
VIA: Encoder_Input (U38.3), STM32F446 CNC Controller/4 Encoder Inputs/EI (U33_STM32F446_CNC_Controller_4_Encoder_Inputs_EI#3.2)
VIA: Encoder_Input (U38.13), STM32F446 CNC Controller/4 Encoder Inputs/EI (U33_STM32F446_CNC_Controller_4_Encoder_Inputs_EI#4.2)
VIA: Encoder_Input (U39.3), STM32F446 CNC Controller/4 Encoder Inputs/EI (U33_STM32F446_CNC_Controller_4_Encoder_Inputs_EI#5.2)
VIA: Encoder_Input (U39.13), STM32F446 CNC Controller/4 Encoder Inputs/EI (U33_STM32F446_CNC_Controller_4_Encoder_Inputs_EI#6.2)
VIA: Aux_Inputs (D37.1 D49.2 R69.2), STM32F446 CNC Controller/Mezzanine Connector/AUX_I/AI (U33_STM32F446_CNC_Controller_Mezzanine_Connector_AUX_I_AI#1.2)
VIA: Aux_Inputs (D31.1 D51.2 R95.2), STM32F446 CNC Controller/Mezzanine Connector/AUX_I/AI (U33_STM32F446_CNC_Controller_Mezzanine_Connector_AUX_I_AI#2.2)
VIB: Encoder_Input (U36.5), STM32F446 CNC Controller/4 Encoder Inputs/EI (U33_STM32F446_CNC_Controller_4_Encoder_Inputs_EI#1.3)
VIB: Encoder_Input (U36.11), STM32F446 CNC Controller/4 Encoder Inputs/EI (U33_STM32F446_CNC_Controller_4_Encoder_Inputs_EI#2.3)
VIB: Encoder_Input (U38.5), STM32F446 CNC Controller/4 Encoder Inputs/EI (U33_STM32F446_CNC_Controller_4_Encoder_Inputs_EI#3.3)
VIB: Encoder_Input (U38.11), STM32F446 CNC Controller/4 Encoder Inputs/EI (U33_STM32F446_CNC_Controller_4_Encoder_Inputs_EI#4.3)
VIB: Encoder_Input (U39.5), STM32F446 CNC Controller/4 Encoder Inputs/EI (U33_STM32F446_CNC_Controller_4_Encoder_Inputs_EI#5.3)
VIB: Encoder_Input (U39.11), STM32F446 CNC Controller/4 Encoder Inputs/EI (U33_STM32F446_CNC_Controller_4_Encoder_Inputs_EI#6.3)
VIB: Aux_Inputs (D35.1 D50.2 R75.2), STM32F446 CNC Controller/Mezzanine Connector/AUX_I/AI (U33_STM32F446_CNC_Controller_Mezzanine_Connector_AUX_I_AI#1.3)
VIB: Aux_Inputs (D30.1 D52.2 R96.2), STM32F446 CNC Controller/Mezzanine Connector/AUX_I/AI (U33_STM32F446_CNC_Controller_Mezzanine_Connector_AUX_I_AI#2.3)
X_LIM: MCU_STM32H723ZGT6 (U30.90), Limit_Switches (R6.2), STM32F446 CNC Controller/Mezzanine Connector/LIM_SW/PH_DR (C54_STM32F446_CNC_Controller_Mezzanine_Connector_LIM_SW_PH_DR#1.2 R20_STM32F446_CNC_Controller_Mezzanine_Connector_LIM_SW_PH_DR#1.1 U2_STM32F446_CNC_Controller_Mezzanine_Connector_LIM_SW_PH_DR#1.4)
XLIM_EXT_n: Mezz_connector (P2.11), STM32F446 CNC Controller/Mezzanine Connector/LIM_SW/PH_DR (U2_STM32F446_CNC_Controller_Mezzanine_Connector_LIM_SW_PH_DR#1.2)
XLIM_EXT_p: Mezz_connector (P2.9), STM32F446 CNC Controller/Mezzanine Connector/LIM_SW/PH_DR (R21_STM32F446_CNC_Controller_Mezzanine_Connector_LIM_SW_PH_DR#1.1)
Y_LIM: MCU_STM32H723ZGT6 (U30.21), Limit_Switches (R15.2), STM32F446 CNC Controller/Mezzanine Connector/LIM_SW/PH_DR (C54_STM32F446_CNC_Controller_Mezzanine_Connector_LIM_SW_PH_DR#2.2 R20_STM32F446_CNC_Controller_Mezzanine_Connector_LIM_SW_PH_DR#2.1 U2_STM32F446_CNC_Controller_Mezzanine_Connector_LIM_SW_PH_DR#2.4)
YLIM_EXT_n: Mezz_connector (P2.15), STM32F446 CNC Controller/Mezzanine Connector/LIM_SW/PH_DR (U2_STM32F446_CNC_Controller_Mezzanine_Connector_LIM_SW_PH_DR#2.2)
YLIM_EXT_p: Mezz_connector (P2.13), STM32F446 CNC Controller/Mezzanine Connector/LIM_SW/PH_DR (R21_STM32F446_CNC_Controller_Mezzanine_Connector_LIM_SW_PH_DR#2.1)
Z_LIM: MCU_STM32H723ZGT6 (U30.53), Limit_Switches (R16.2), STM32F446 CNC Controller/Mezzanine Connector/LIM_SW/PH_DR (C54_STM32F446_CNC_Controller_Mezzanine_Connector_LIM_SW_PH_DR#3.2 R20_STM32F446_CNC_Controller_Mezzanine_Connector_LIM_SW_PH_DR#3.1 U2_STM32F446_CNC_Controller_Mezzanine_Connector_LIM_SW_PH_DR#3.4)
ZLIM_EXT_n: Mezz_connector (P2.19), STM32F446 CNC Controller/Mezzanine Connector/LIM_SW/PH_DR (U2_STM32F446_CNC_Controller_Mezzanine_Connector_LIM_SW_PH_DR#3.2)
ZLIM_EXT_p: Mezz_connector (P2.17), STM32F446 CNC Controller/Mezzanine Connector/LIM_SW/PH_DR (R21_STM32F446_CNC_Controller_Mezzanine_Connector_LIM_SW_PH_DR#3.1)

## Assembly variants
SMT_ONLY: not fitted A1 J1_LS_A J1_LS_X J1_LS_Y J1_LS_Z J2_LS_A J2_LS_X J2_LS_Y J2_LS_Z J3_PH_CY J3_PH_CY J3_PH_FD J3_PH_HLT J3_PH_PR J4 J6 J6 J7 J8 J8 J9 P1 P2 P2 P3 P3 P4 P4 P5 P5 P6 P6 P7 P7 P8 P9 P9 P10 P10 P11 P11 P12 P12 P13 P13 P14 P14 P16 P16 P17 P18 P19 P19 P20 P20 P21 P21 P22 P22 P23 P23 P24 P24 P25 P25 P26 P27 P28 P29 R? U30
FULL_PLACE: not fitted P1 P8 P8 P18 P18 P20 R43 R44 R134 R? R? R? U30